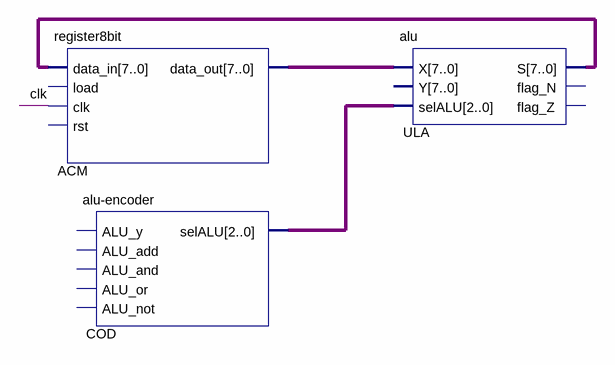
[diagram p0: schematic sheet]
// Quartus schematic incomplete.bdf as structural Verilog: 3 symbols, 0 pins
module incomplete (
);

  wire clk;
  wire [2:0] COD_selalu;
  wire [7:0] ACM_data_out, ULA_s;

  register8bit ACM (.data_in(ULA_s), .clk(clk), .data_out(ACM_data_out));  // open: load, rst
  \alu-encoder  COD (.selALU(COD_selalu));  // open: ALU_y, ALU_add, ALU_and, ALU_or, ALU_not
  alu ULA (.X(ACM_data_out), .selALU(COD_selalu), .S(ULA_s));  // open: Y, flag_N, flag_Z
endmodule
